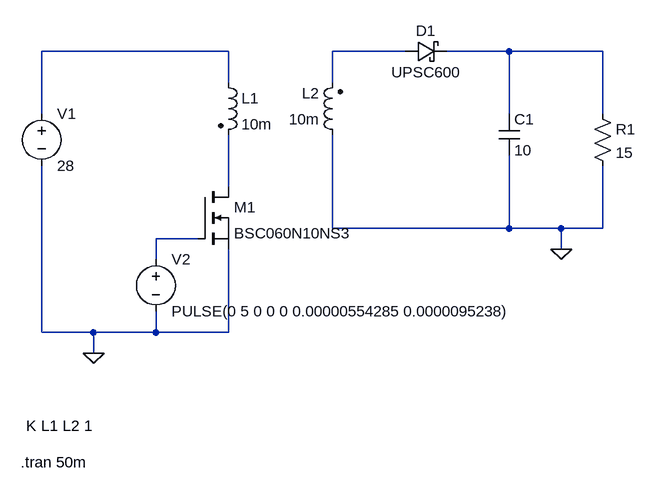
[diagram p0: schematic flyback_circuit.asc]
flyback_circuit.asc, the LTspice schematic file:
Version 4
SHEET 1 880 680
WIRE 64 0 -224 0
WIRE 336 0 224 0
WIRE 496 0 400 0
WIRE 640 0 496 0
WIRE 64 48 64 0
WIRE 224 48 224 0
WIRE -224 96 -224 0
WIRE 496 96 496 0
WIRE 640 96 640 0
WIRE 64 208 64 128
WIRE 224 272 224 128
WIRE 496 272 496 160
WIRE 496 272 224 272
WIRE 576 272 496 272
WIRE 640 272 640 176
WIRE 640 272 576 272
WIRE 16 288 -48 288
WIRE 576 304 576 272
WIRE -48 320 -48 288
WIRE -224 432 -224 176
WIRE -144 432 -224 432
WIRE -48 432 -48 400
WIRE -48 432 -144 432
WIRE 64 432 64 304
WIRE 64 432 -48 432
WIRE -144 464 -144 432
FLAG -144 464 0
FLAG 576 304 0
SYMBOL voltage -224 80 R0
WINDOW 123 0 0 Left 0
WINDOW 39 0 0 Left 0
SYMATTR InstName V1
SYMATTR Value 28
SYMBOL res 624 80 R0
SYMATTR InstName R1
SYMATTR Value 15
SYMBOL voltage -48 304 R0
WINDOW 123 0 0 Left 0
WINDOW 39 0 0 Left 0
SYMATTR InstName V2
SYMATTR Value PULSE(0 5 0 0 0 0.00000554285 0.0000095238)
SYMBOL schottky 336 16 R270
WINDOW 0 32 32 VTop 2
WINDOW 3 0 32 VBottom 2
SYMATTR InstName D1
SYMATTR Value UPSC600
SYMATTR Description Diode
SYMATTR Type diode
SYMBOL nmos 16 208 R0
SYMATTR InstName M1
SYMATTR Value BSC060N10NS3
SYMBOL ind2 48 32 R0
SYMATTR InstName L1
SYMATTR Value 10m
SYMATTR Type ind
SYMBOL ind2 240 144 R180
WINDOW 0 36 80 Left 2
WINDOW 3 36 40 Left 2
SYMATTR InstName L2
SYMATTR Value 10m
SYMATTR Type ind
SYMBOL cap 480 96 R0
SYMATTR InstName C1
SYMATTR Value 10
TEXT -256 632 Left 2 !.tran 50m
TEXT -248 576 Left 2 !K L1 L2 1

The netlist it stands for:
* flyback_circuit.asc
V1 N001 0 28
R1 N003 0 15
V2 N005 0 PULSE(0 5 0 0 0 0.00000554285 0.0000095238)
D1 N002 N003 UPSC600
M1 N004 N005 0 0 BSC060N10NS3
L1 N001 N004 10m
L2 0 N002 10m
C1 N003 0 10
.model D D
.lib standard.dio
.model NMOS NMOS
.model PMOS PMOS
.lib standard.mos
.tran 50m
K L1 L2 1
.backanno
.end